# EAGLE design HAT (EAGLE 9.5.1)
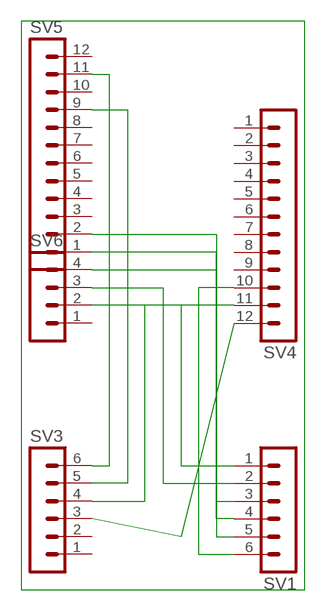
[diagram p0: schematic, sheet 1]

## Parts
SV1  MA06-1  [MA06-1]
SV3  MA06-1  [MA06-1]
SV4  MA12-1  [MA12-1]
SV5  MA12-1  [MA12-1]
SV6  MA04-1  [MA04-1]

## Nets
N$2: SV3.3 SV4.12
N$3: SV3.4 SV4.11
N$4: SV3.6 SV5.11
N$5: SV3.5 SV5.9
N$6: SV1.1 SV6.2
N$7: SV1.2 SV6.3
N$8: SV1.3 SV6.4
N$9: SV1.4 SV5.1
N$10: SV1.5 SV5.2
N$11: SV1.6 SV4.10
Unconnected: SV3.1 SV3.2 SV4.1 SV4.2 SV4.3 SV4.4 SV4.5 SV4.6 SV4.7 SV4.8 SV4.9 SV5.3 SV5.4 SV5.5 SV5.6 SV5.7 SV5.8 SV5.10 SV5.12 SV6.1

## Library data of the parts
SV1 SV3 = con-lstb:MA06-1: PIN HEADER; OC_FARNELL: unknown; OC_NEWARK: unknown
SV4 SV5 = con-lstb:MA12-1: PIN HEADER; OC_FARNELL: unknown; OC_NEWARK: unknown
SV6 = con-lstb:MA04-1: PIN HEADER; OC_FARNELL: unknown; OC_NEWARK: unknown

## Board
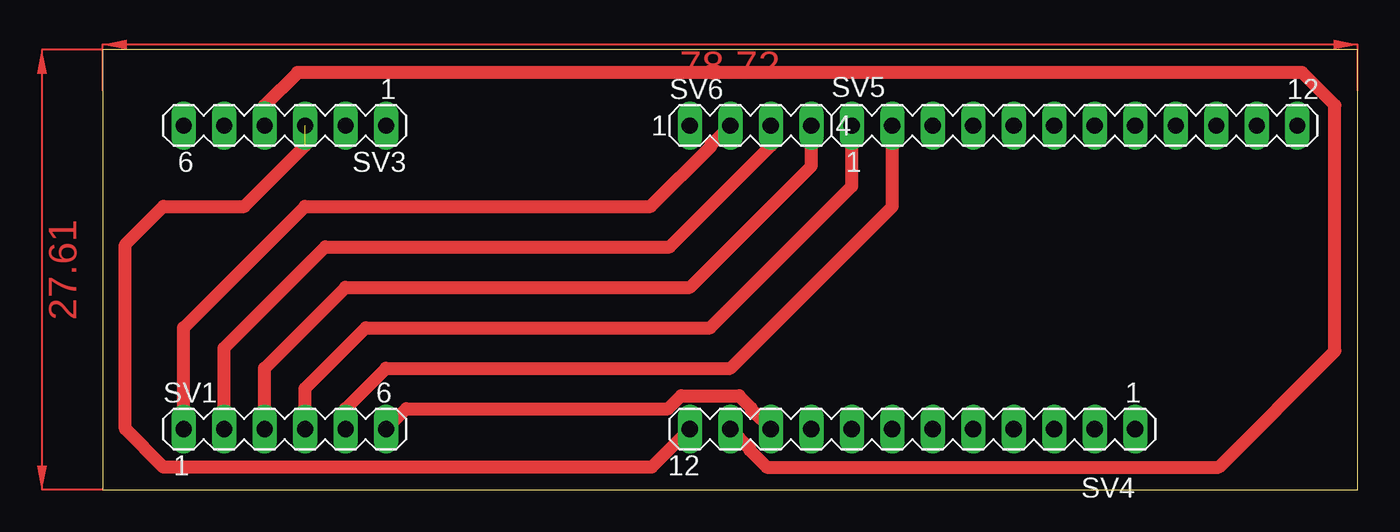
[diagram p1: board, top side]
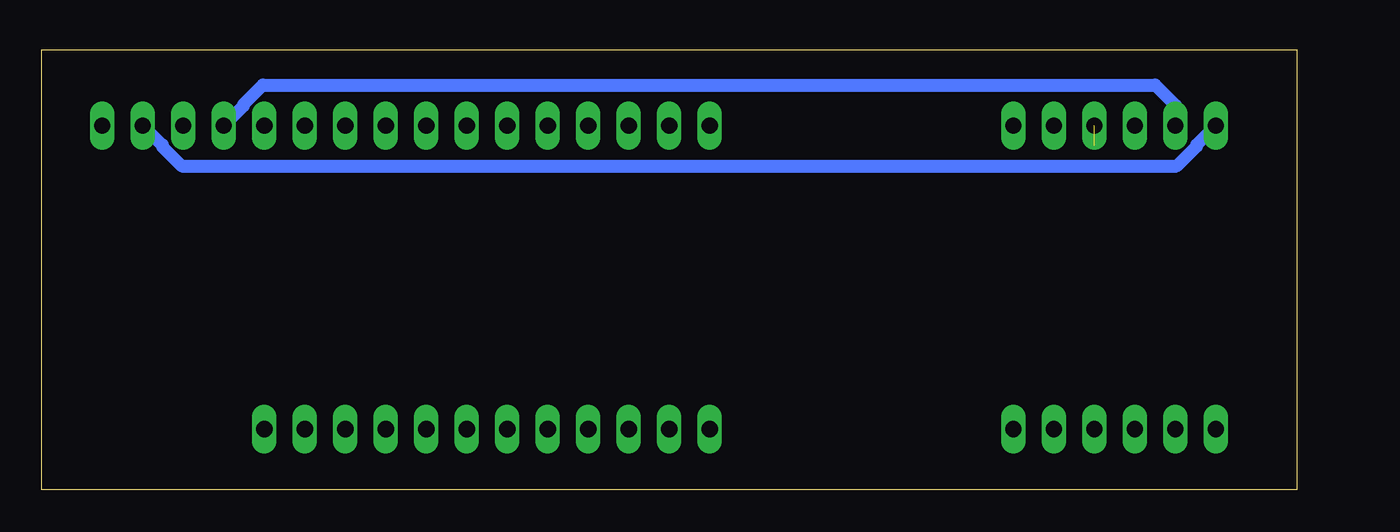
[diagram p2: board, bottom side, seen from below]

Size 78.72 x 27.61 mm. Coordinates in mm from the lower left corner, seen from the top.
Outline: 0,0 78.72,0 78.72,27.61 0,27.61 0,0
Copper layers (1*16): Top 0.035mm / dielectric 1.5mm / Bottom 0.035mm
Design rules "default": minimum track width 6mil, minimum drill 0.35mm, track to track 6mil, track to pad 6mil, pad to pad 6mil, via to via 6mil, smd to smd 6mil, copper to edge 40mil, drill to drill 6mil, minimum pad ring 10mil, minimum via ring 8mil, stop-mask expansion 4mil, vias tented up to drill 0mil, thermal gap 10mil

### Footprints (pad centres in the part's own frame; a part is rotated, then mirrored left to right if it is on the bottom)
MA06-1 = drill 1.016 long: 1 -6.35,0; 2 -3.81,0; 3 -1.27,0; 4 1.27,0; 5 3.81,0; 6 6.35,0
MA12-1 = drill 1.016 long: 1 -13.97,0; 2 -11.43,0; 3 -8.89,0; 4 -6.35,0; 5 -3.81,0; 6 -1.27,0; 7 1.27,0; 8 3.81,0; 9 6.35,0; 10 8.89,0; 11 11.43,0; 12 13.97,0
MA04-1 = drill 1.016 long: 1 -3.81,0; 2 -1.27,0; 3 1.27,0; 4 3.81,0

### Placement (x,y rotation side)
SV1  11.43,3.81 0 top
SV3  11.43,22.86 180 top
SV4  50.8,3.81 180 top
SV5  60.96,22.86 0 top
SV6  40.64,22.86 0 top

### Tracks (layer width: path | path; a pad name or v marks a point on that pad's centre or on a via)
N$2  (1 unrouted)
  Top 0.813: SV4.12 34.44,1.42 3.81,1.42 1.42,3.81 1.42,15.39 3.81,17.78 8.89,17.78 12.7,21.59
N$3
  Top 0.813: SV4.11 40.59,2.59 40.59,2.5 41.67,1.42 70,1.42 77.3,8.72 77.3,24.13 75.24,26.19 12.22,26.19 10.16,24.13 SV3.4
N$4
  Bottom 0.813: SV5.11 71.17,21.64 71.17,21.55 69.94,20.32 7.53,20.32 6.3,21.55 6.3,21.64 SV3.6
N$5
  Bottom 0.813: SV5.9 66.09,24.08 66.09,24.17 64.86,25.4 8.89,25.4 7.62,24.13 SV3.5
N$6
  Top 0.813: SV6.2 38.15,21.64 38.15,21.55 34.38,17.78 12.7,17.78 5.08,10.16 SV1.1
N$7
  Top 0.813: SV1.2 7.62,8.89 13.97,15.24 35.56,15.24 41.91,21.59 SV6.3
N$8
  Top 0.813: SV1.3 10.16,7.62 15.24,12.7 36.83,12.7 44.45,20.32 SV6.4
N$9
  Top 0.813: SV1.4 12.7,6.35 16.51,10.16 38.1,10.16 46.99,19.05 SV5.1
N$10
  Top 0.813: SV1.5 15.24,5.08 17.78,7.62 39.37,7.62 49.53,17.78 SV5.2
N$11
  Top 0.813: SV1.6 19.05,5.08 35.47,5.08 36.28,5.89 39.92,5.89 40.69,5.12 40.69,5.03 SV4.10
(copper drawn outside any net)
  shapes: Top area x2